# EAGLE design B1 (EAGLE 9.6.2)
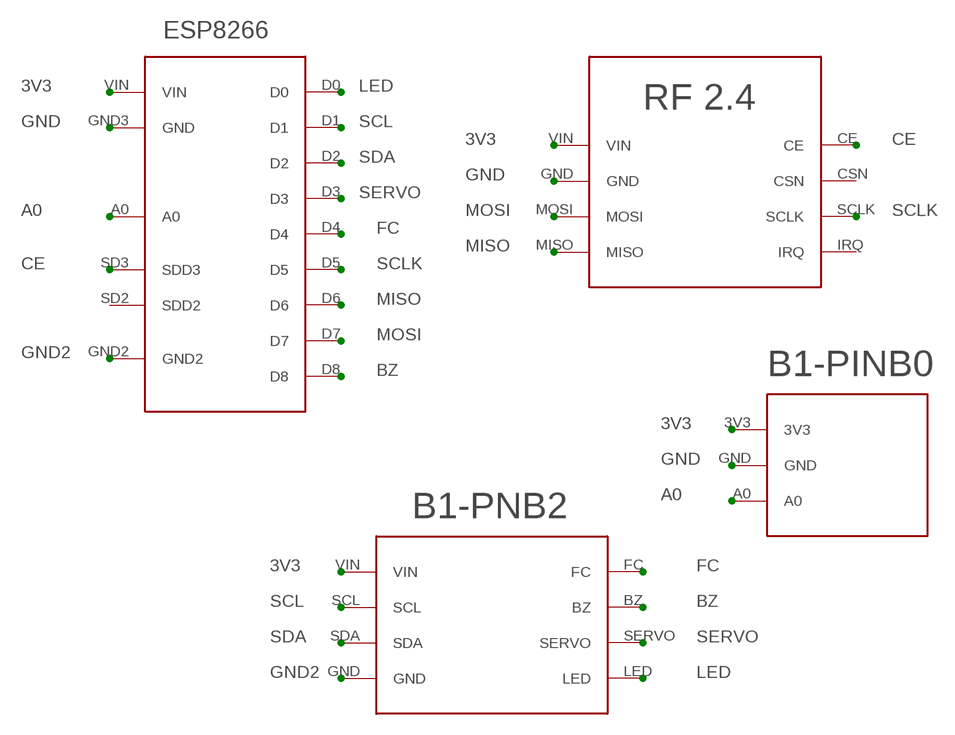
[diagram p0: schematic, sheet 1]

## Parts
U$1  ESP8266  [ESP8266]
U$2  RF  [RF]
U$3  B1-PINB2  [B1-PINB2]
U$4  B1-PINB0  [B1-PINB0]

## Nets
3V3: U$1.VIN U$2.VIN U$3.VIN U$4.3V3
A0: U$1.A0 U$4.A0
BZ: U$1.D8 U$3.BZ
CE: U$1.SD3(SDD3) U$2.CE
FC: U$1.D4 U$3.FC
GND: U$1.GND3(GND) U$2.GND U$4.GND
GND2: U$1.GND2 U$3.GND
LED: U$1.D0 U$3.LED
MISO: U$1.D6 U$2.MISO
MOSI: U$1.D7 U$2.MOSI
SCL: U$1.D1 U$3.SCL
SCLK: U$1.D5 U$2.SCLK
SDA: U$1.D2 U$3.SDA
SERVO: U$1.D3 U$3.SERVO
Unconnected: U$1.SD2(SDD2) U$2.CSN U$2.IRQ

## Library data of the parts
U$1 = CANSAT:ESP8266
U$2 = CANSAT:RF
U$3 = CANSAT:B1-PINB2
U$4 = CANSAT:B1-PINB0

## Board
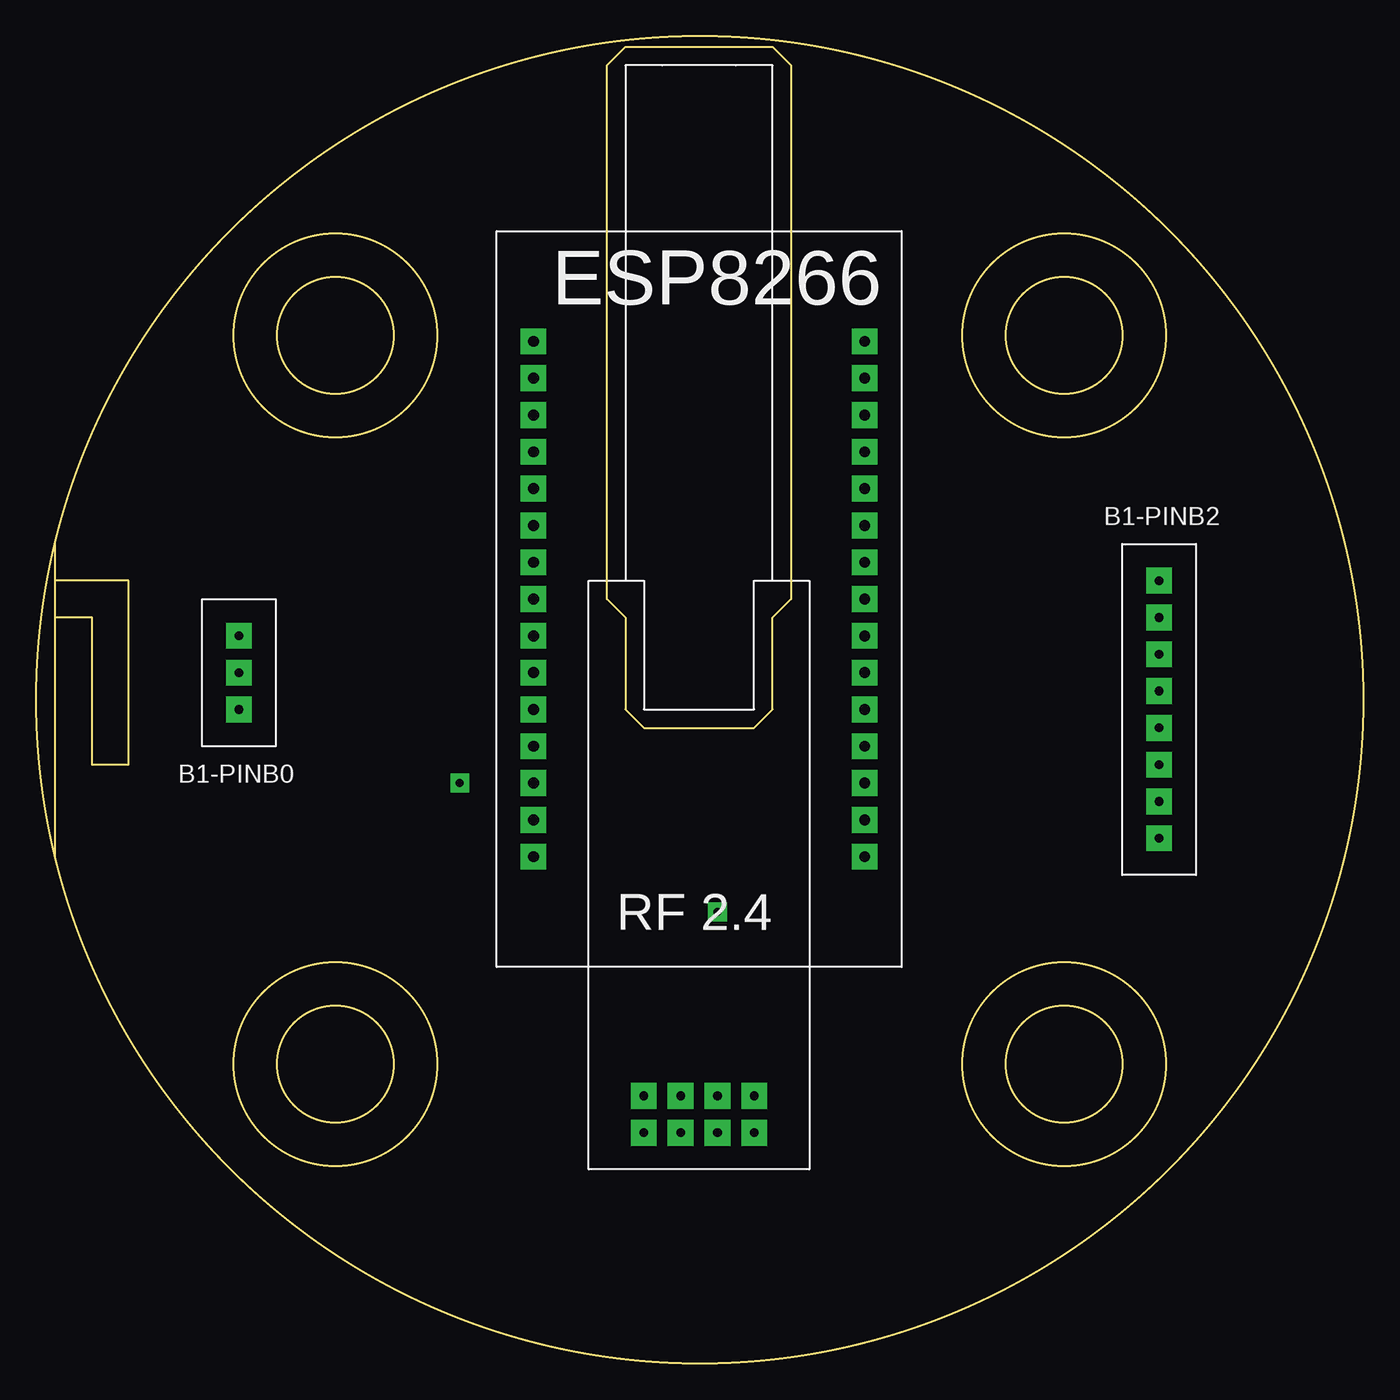
[diagram p1: board, top side]
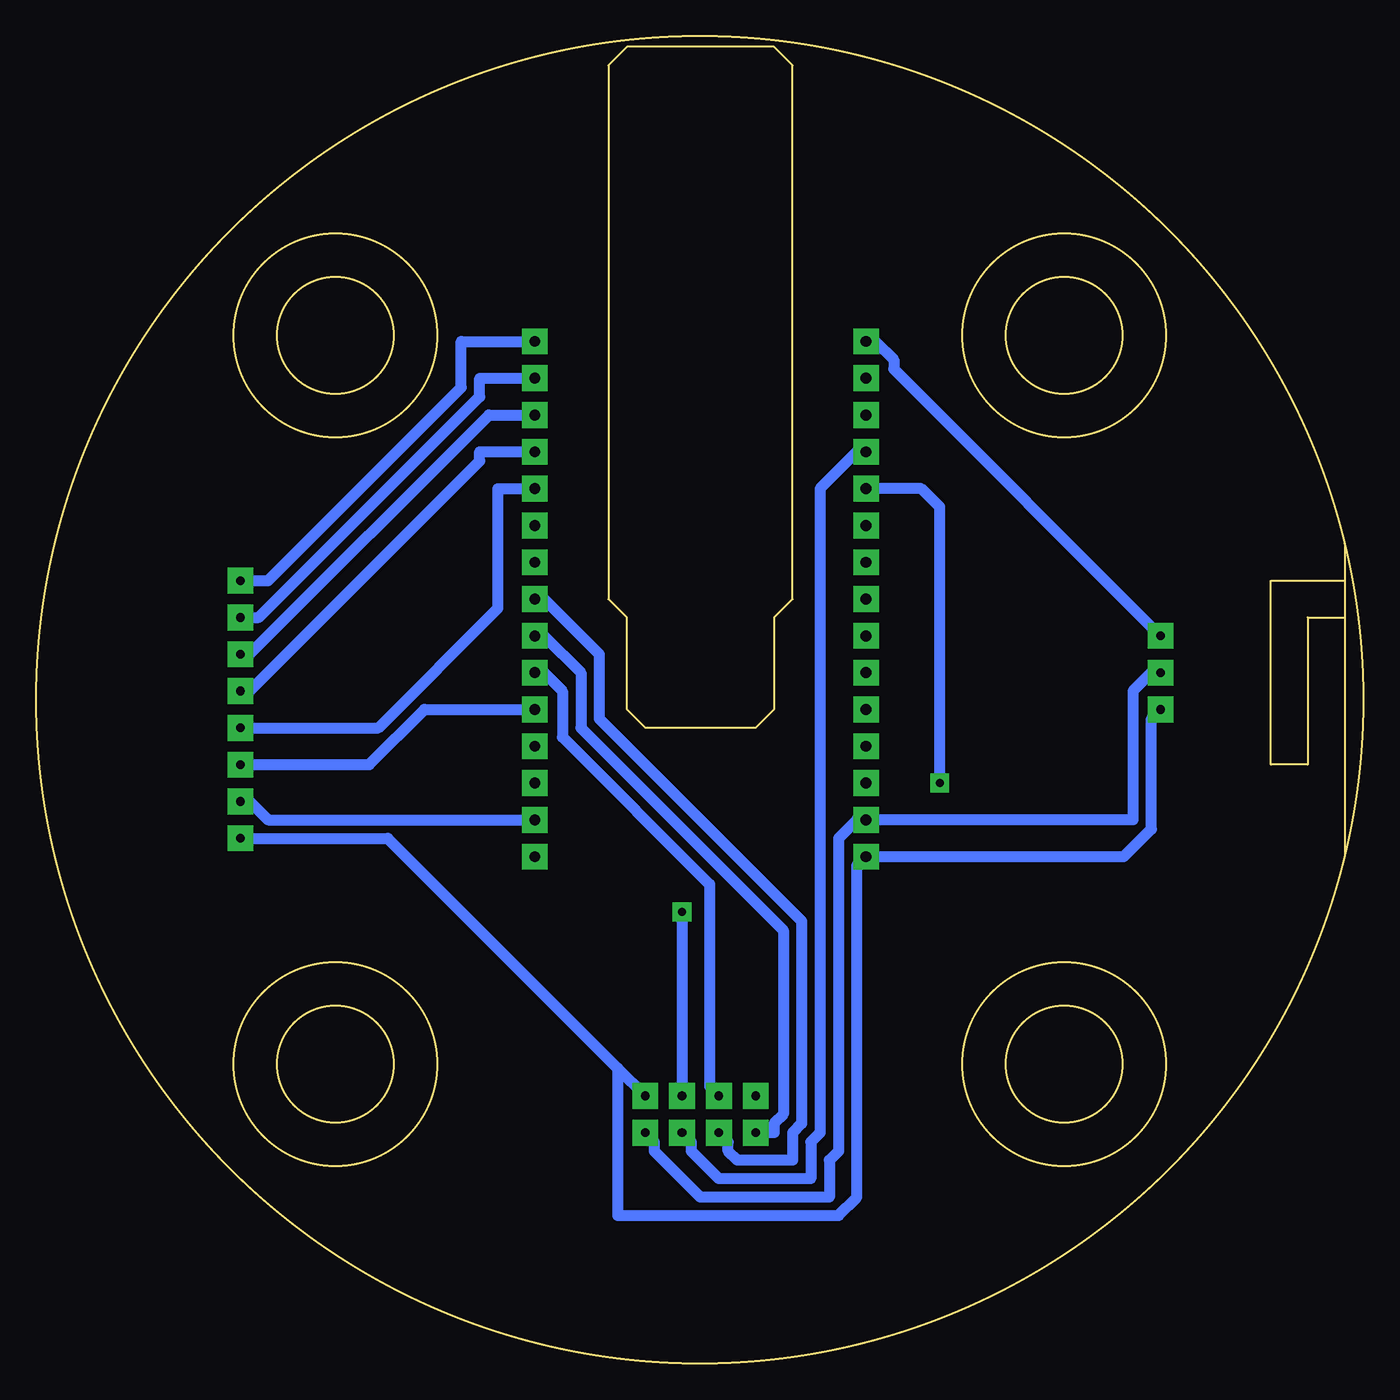
[diagram p2: board, bottom side, seen from below]

Size 91.58 x 91.58 mm. Coordinates in mm from the lower left corner, seen from the top.
Outline: 1.29,56.55 1.29,54.01
Outline: 1.29,54.01 1.29,51.47
Outline: 1.29,51.47 1.29,34.96
Outline: 1.29,51.47 3.83,51.47 3.83,41.31 6.37,41.31 6.37,54.01 1.29,54.01
Outline: 39.39,52.74 40.66,51.47 40.66,45.12 41.93,43.85 49.55,43.85 50.82,45.12 50.82,51.47 52.09,52.74 52.09,89.57 50.82,90.84 40.66,90.84 39.39,89.57 39.39,52.74
Outline: circle at 45.79,45.79 radius 45.79
Outline: circle at 20.65,20.65 radius 4
Outline: circle at 20.65,70.94 radius 4
Outline: circle at 70.94,20.65 radius 4
Outline: circle at 70.94,70.94 radius 4
Outline: circle at 20.65,70.94 radius 7
Outline: circle at 70.94,70.94 radius 7
Outline: circle at 70.94,20.65 radius 7
Outline: circle at 20.65,20.65 radius 7
Copper layers (1*16): Top 0.035mm / dielectric 1.5mm / Bottom 0.035mm
Design rules "default *": minimum track width 30mil, minimum drill 0.35mm, track to track 20mil, track to pad 20mil, pad to pad 6mil, via to via 6mil, smd to smd 6mil, copper to edge 40mil, drill to drill 6mil, minimum pad ring 10mil, minimum via ring 8mil, stop-mask expansion 4mil, vias tented up to drill 0mil, thermal gap 10mil

### Footprints (pad centres in the part's own frame; a part is rotated, then mirrored left to right if it is on the bottom)
ESP8266 = drill 0.75 pad 1.778 square: 3.31 22.86,-12.7; 3.32 22.86,-35.56; 3.33 0,-25.4; A0 0,0; CLK 0,-20.32; CMD 0,-15.24; D0 22.86,0; D1 22.86,-2.54; D2 22.86,-5.08; D3 22.86,-7.62; D4 22.86,-10.16; D5 22.86,-17.78; D6 22.86,-20.32; D7 22.86,-22.86; D8 22.86,-25.4; EN 0,-27.94; GND1 22.86,-15.24; GND2 22.86,-33.02; GND3 0,-33.02; GND4 0,-22.86; RST 0,-30.48; RSV1 0,-5.08; RSV2 0,-2.54; RX 22.86,-27.94; SD0 0,-17.78; SD1 0,-12.7; SD2 0,-10.16; SD3 0,-7.62; TX 22.86,-30.48; VIN 0,-35.56
RF = drill 0.6 pad 1.778 square: CE 6.35,-2.54; CSN 6.35,-5.08; GND 3.81,-2.54; IRQ 11.43,-5.08; MISO 11.43,-2.54; MOSI 8.89,-5.08; SCLK 8.89,-2.54; VIN 3.81,-5.08
B1-PINB2 = drill 0.6 pad 1.778 square: BZ 2.54,-15.24; FC 2.54,-12.7; GND 2.54,-17.78; LED 2.54,-2.54; SCL 2.54,-5.08; SDA 2.54,-7.62; SERVO 2.54,-10.16; VIN 2.54,-20.32
B1-PINB0 = drill 0.6 pad 1.778 square: 3V3 2.54,-2.54; A0 2.54,-7.62; GND 2.54,-5.08

### Placement (x,y rotation side)
U$1  34.31,70.52 0 top
U$2  53.36,13.37 180 top
U$3  74.95,56.55 0 top
U$4  16.53,42.58 180 top

### Tracks (layer width: path | path; a pad name or v marks a point on that pad's centre or on a via)
3V3
  Bottom 0.762: U$4.3V3 14.63,44.49 14.63,36.87 16.53,34.96 U$1.VIN 34.95,34.33 34.95,11.47 36.22,10.2 51.46,10.2 51.46,20.36 | 51.46,20.36 55.9,24.8 67.33,36.23 U$3.VIN | 51.46,20.36 U$2.VIN
A0
  Bottom 0.762: U$4.A0 32.41,68.62 32.41,69.25 33.68,70.52 U$1.A0
BZ
  Bottom 0.762: U$1.D8 64.79,45.12 68.6,41.31 U$3.BZ
CE
  Bottom 0.762: U$2.CE 46.38,15.28 46.38,14.64 44.47,12.74 38.12,12.74 38.12,15.28 37.49,15.91 37.49,60.36 34.95,62.9 U$1.SD3
FC
  Bottom 0.762: U$1.D4 59.71,60.36 59.71,52.11 67.97,43.85 U$3.FC
GND
  Bottom 0.762: U$4.GND 14.63,47.66 15.9,46.39 15.9,37.5 U$1.GND3 34.95,37.5 36.22,36.23 36.22,14.64 36.85,14.01 36.85,11.47 45.74,11.47 48.92,14.64 48.92,15.28 U$2.GND
GND2
  Bottom 0.762: U$1.GND2 75.59,37.5 76.86,38.77 U$3.GND
LED
  Bottom 0.762: U$1.D0 62.25,70.52 62.25,67.35 75.59,54.01 U$3.LED
MISO
  Bottom 0.762: U$2.MISO 40.66,15.91 40.66,16.55 40.03,17.18 40.03,29.88 54,43.85 54,47.66 56.54,50.2 U$1.D6
MOSI
  Bottom 0.762: U$2.MOSI 45.11,19.09 45.11,33.06 55.27,43.22 55.27,46.39 56.54,47.66 U$1.D7
N$1  (via drill 0.55 pad 1.3)
  Bottom 0.762: v47.01,31.15 47.01,18.45
N$2  (via drill 0.55 pad 1.3)
  Bottom 0.762: v29.23,40.04 29.23,59.09 30.5,60.36 34.31,60.36
SCL
  Bottom 0.762: U$1.D1 60.98,67.98 60.98,66.71 76.22,51.47 U$3.SCL
SCLK
  Bottom 0.762: U$2.SCLK 43.84,15.28 43.84,14.64 43.2,14.01 39.39,14.01 39.39,15.91 38.76,16.55 38.76,30.52 52.73,44.49 52.73,48.93 56.54,52.74 U$1.D5
SDA
  Bottom 0.762: U$1.D2 60.35,65.44 76.86,48.93 U$3.SDA
SERVO
  Bottom 0.762: U$1.D3 60.98,62.9 60.98,62.27 76.86,46.39 U$3.SERVO